# EAGLE design Adafruit_ADS1115_16Bit_I2C_ADC (EAGLE 9.6.2)
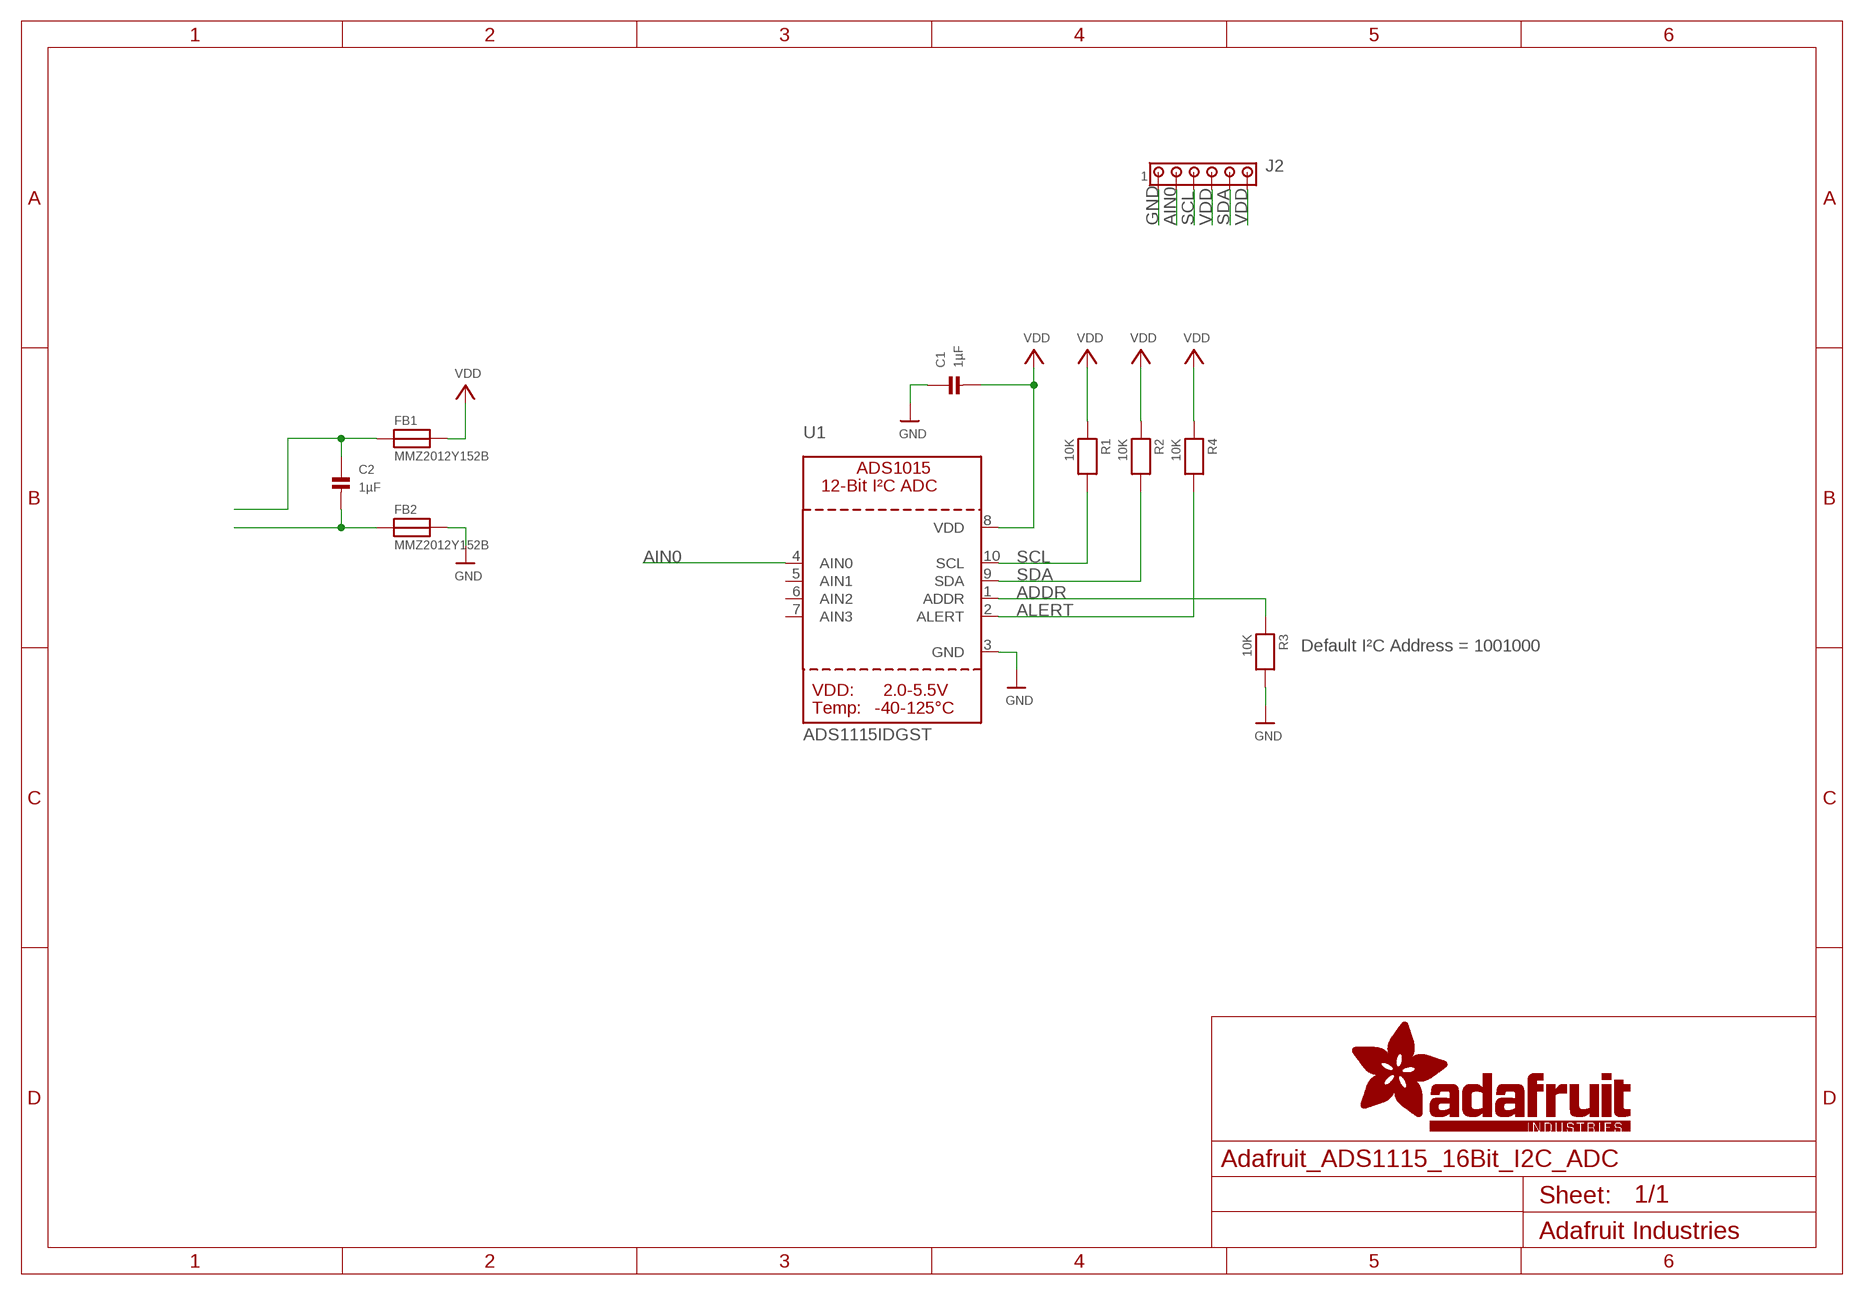
[diagram p0: schematic, sheet 1]

## Parts
C1  1µF  CAP_CERAMIC0805  [0805]
C2  1µF  CAP_CERAMIC0805  [0805]
FB1  MMZ2012Y152B  FERRITE0805  [0805]
FB2  MMZ2012Y152B  FERRITE0805  [0805]
J2  MTA06-156  [1X6MTA]
R1  10K  RESISTOR0805  [0805]
R2  10K  RESISTOR0805  [0805]
R3  10K  RESISTOR0805  [0805]
R4  10K  RESISTOR0805  [0805]
U1  ADS1115IDGST  ADC_ADS1015  [MSOP10]

## Nets
ADDR: R3.1 U1.1(ADDR)
AIN0: J2.2 U1.4(AIN0)
ALERT: R4.2 U1.2(ALERT)
GND: C1.1 FB2.2 J2.1 R3.2 U1.3(GND)
N$1: C2.1 FB1.1
N$2: C2.2 FB2.1
SCL: J2.3 R1.2 U1.10(SCL)
SDA: J2.5 R2.2 U1.9(SDA)
VDD: C1.2 FB1.2 J2.4 J2.6 R1.1 R2.1 R4.1 U1.8(VDD)
Unconnected: U1.5(AIN1) U1.6(AIN2) U1.7(AIN3)

## Notes on the sheet
- Default I²C Address = 1001000

## Library data of the parts
C1 C2 = microbuilder:CAP_CERAMIC: Ceramic Capacitors 0402 - 0402 Surface Mount Capacitors 16pF 50V 5% [Digikey: 445-4899-2-ND] 18pF 50V 5% [Digikey: 490-1281-2-ND] 22pF 50V 5% [Digikey: 490-1283-2-ND] 68pF 50V 5% [Digikey: 490-1289-2-ND] 0.1uF 10V 10% [Digikey: 490-1318-2-ND] 1.0uF 6.3V 10% [Digikey: 490-1320-2-ND] 0603 - 0603 Surface Mount Capacitors 16 pF 50V 5% [Digikey: 445-5051-2-ND] 22 pF 50V [Digikey: PCC220ACVTR-ND] 33 pF 50V 5% [Digikey: 490-1415-1-ND] 56pF 50V 5% [Digikey: 490-1421-1-ND] 220pF 50V 5% [Digikey: 445-1285-1-ND] 680 pF 50V 2200 pF 50V 5% C0G [Digikey: 445-1297-1-ND] 5600 pF 100V 5% X7R [Digikey: 478-3711-1-ND] 0.1 µF 25V 10% [Digikey: PCC2277TR-ND] 0.22 µF 16V 10% X7R [Digikey: 445-1318-1-ND] 1.0 µF 25V 10% [Digikey: 445-5146-2-ND] 0603 - RF Specific 3pF 250V +/-0.1pF RF [Digikey: 712-1347-1-ND] 18 pF 250V 5% [Digikey: 478-3505-1-ND or 712-1322-1-ND] 56 pF 250V 5% C0G RF [Digikey: 490-4867-1-ND] 68 pF 250V RF [Digikey: 490-4868-1-ND] 0805 - 0805 Surface Mount Capacitors 220 pF 250V 2% RF Ceramic Capacitor [Digikey: 712-1398-1-ND] 1000 pF 50V 2% NP0 Ceramic Capacitor [Digikey: 478-3760-1-ND] 0.1 µF 25V 10% Ceramic Capacitor [Digikey: PCC1828TR-ND] 1.0 µF 16V 10% Ceramic Capacitor[Digikey: 490-1691-2-ND] 10.0 µF 10V 10% Ceramic Capacitor[Digikey: 709-1228-1-ND] 10.0 uF 16V 10% Ceramic Capacitor [Digikey: 478-5165-2-ND] 47 uF 6.3V 20% Ceramic Capacitor [Digikey: 587-1779-1-ND or 399-5506-1-ND] 1206 - 1206 Surface Mount Capacitors 47uF 10V 20% Ceramic Capacitor [Digikey: 490-5528-1-ND or 399-5508-1-ND or 445-6010-1-ND] 100uF 6.3V -20%, +80% Y5V Ceramic Capacitor (Digikey: 490-4512-1-ND, Mouser: 81-GRM31CF50J107ZE1L)
FB1 FB2 = microbuilder:FERRITE: Ferrite Bead 0603 MMZ1608B121C - 120 Ohm, 600mA Ferrite Chip - Digikey: 445-2164-1-ND BK1608HW121-T - 120 Ohm, 600mA Ferrite Chip - Digikey: 587-1876-2-ND 0805 HZ0805B272R-10 - 2.7K Ohm @ 100MHz, 200mA 0.8 Ohm DC Resistance - Digikey: 240-2504-1-ND (see also Murata BLM21BD272SN1L)
J2 = con-amp:MTA06-156: AMP connector
R1-R4 = microbuilder:RESISTOR: Resistors 0402 - 0402 Surface Mount Package 22 Ohm 1% 1/16W [Digikey: 311-22.0LRTR-ND] 33 Ohm 5% 1/16W 1.0K 5% 1/16W 1.5K 5% 1/16W 2.0K 1% 1/16W 10.0K 1% 1/16W [Digikey: 311-10.0KLRTR-ND] 10.0K 5% 1/16W [Digikey: RMCF0402JT10K0TR-ND] 12.1K 1% 1/16W [Digikey: 311-22.0LRTR-ND] 100.0K 5% 1/16W 0603 - 0603 Surface Mount Package 0 Ohm 1/10 Watt 1% Resistor 15 Ohm 1/10 Watt 1% Resistor 33 Ohm 1/10 Watt 1% Resistor 49.9 Ohm 1/10 Watt 1% Resistor 100 Ohm 1/10 Watt 1% Resistor 150 Ohm 1/10 Watt 1% Resistor 240 Ohm 1/10 Watt 1% Resistor 390 Ohm 1/10 Watt 1% Resistor 560 Ohm 1/10 Watt 1% Resistor 680 Ohm 1/10 Watt 1% Resistor 750 Ohm 1/10 Watt 1% Resistor 1.0K Ohm 1/10 Watt 1% Resistor 1.5K Ohm 1/10 Watt 1% Resistor 2.0K Ohm 1/10 Watt 1% Resistor 2.2K Ohm 1/10 Watt 1% Resistor 3.3K Ohm 1/10 Watt 1% Resistor 4.7K Ohm 1/10 Watt 1% Resistor 10.0K Ohm 1/10 Watt 1% Resistor 12.0K Ohm 1/10 Watt 1% Resistor 12.1K Ohm 1/10 Watt 1% Resistor 20.0K Ohm 1/10 Watt 1% Resistor 33.0K Ohm 1/10 Watt 1% Resistor 100.0K Ohm 1/10 Watt 1% Resistor 0805 - 0805 Surface Mount Package 0 Ohm 1/8 Watt 1% Resistor 33 Ohm 1/8 Watt 1% Resistor 100 Ohm 1/8 Watt 1% Resistor 150 Ohm 1/8 Watt 1% Resistor 200 Ohm 1/8 Watt 1% Resistor 240 Ohm 1/8 Watt 1% Resistor 330 Ohm 1/8 Watt 1% Resistor 390 Ohm 1/8 Watt 1% Resistor 470 Ohm 1/8 Watt 1% Resistor 1.0K Ohm 1/8 Watt 1% Resistor 1.5K Ohm 1/8 Watt 1% Resistor 2.0K Ohm 1/8 Watt 1% Resistor 4.7K Ohm 1/8 Watt 1% Resistor 5.1K Ohm 1/8 Watt 1% Resistor 5.6K Ohm 1/8 Watt 1% Resistor 10.0K Ohm 1/8 Watt 1% Resistor 22.0K Ohm 1/8 Watt 1% Resistor 33.0K Ohm 1/8 Watt 1% Resistor 100K Ohm 1/8 Watt 1% Resistor 1206 - 1206 Surface Mount Package 2012 - 2010 Surface Mount Package 0.11 Ohm 1/2 Watt 1% Resistor - Digikey: RHM.11UCT-ND
U1 = microbuilder:ADC_ADS1015: ADS1015 - 12-bit 4-Channel I2C ADC with Internal PGA VDD: 2.0-5.5V Sampling Rate: 3.3ksps Gain Settings: 2/3, 1, 2, 4, 8, 16 I2C Address: ADDR low = 1001000x, ADDR high = 1001001x Internal Comparator The ADS1015 includes an internal comparator that can be set to output a high-level on ALERT when the conversion results exceeeds a pre-defined upper level, and will deassert itself when the level falls below a pre-defined lower threshold level. It can also be set to windowed mode where the ALERT pin will be asserted if the data exceeds the upper threshold or falls below the lower threshold.

## Board
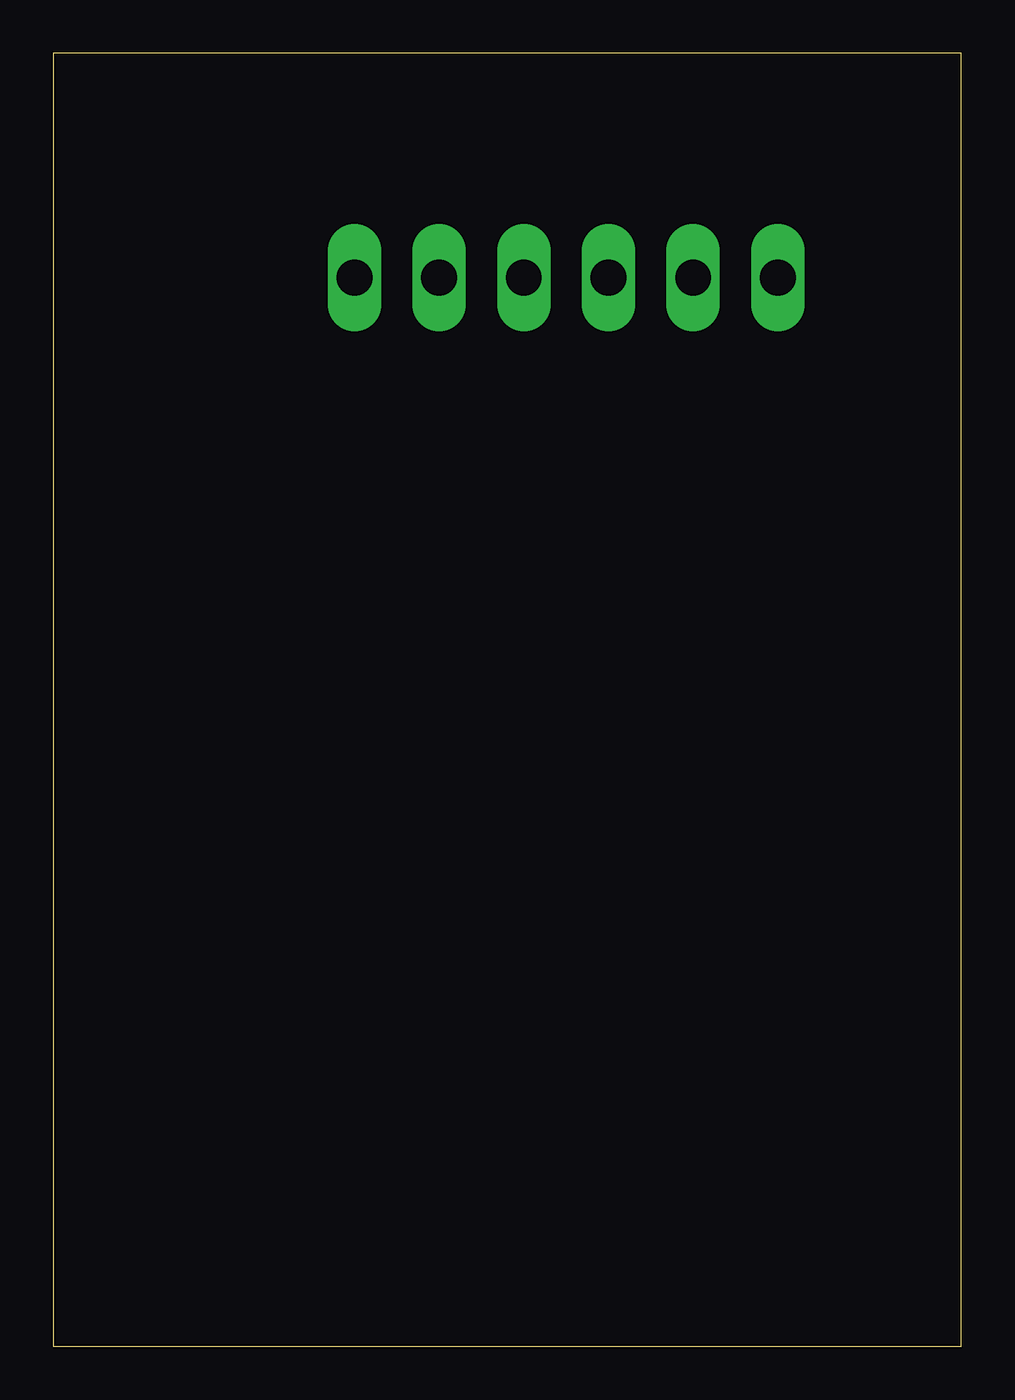
[diagram p1: board, top side]
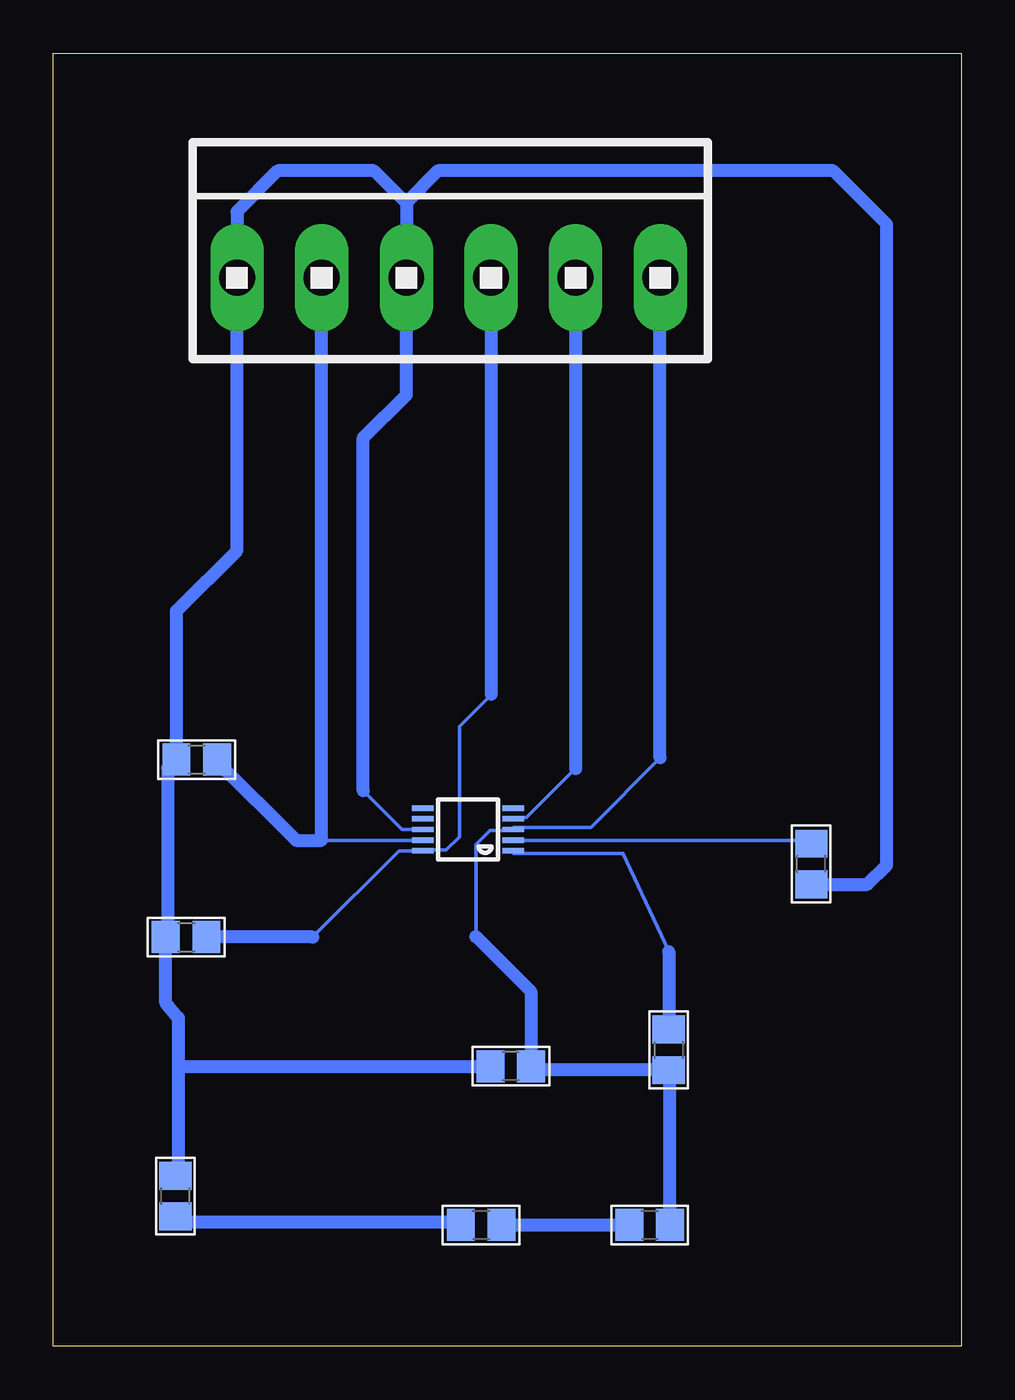
[diagram p2: board, bottom side, seen from below]

Size 42.5 x 60.5 mm. Coordinates in mm from the lower left corner, seen from the top.
Outline: 0,0 42.5,0 42.5,60.5 0,60.5 0,0
Copper layers (1*16): Top 0.035mm / dielectric 1.5mm / Bottom 0.035mm
Design rules "default": minimum track width 6mil, minimum drill 0.35mm, track to track 6mil, track to pad 6mil, pad to pad 6mil, via to via 6mil, smd to smd 6mil, copper to edge 40mil, drill to drill 6mil, minimum pad ring 10mil, minimum via ring 8mil, stop-mask expansion 4mil, vias tented up to drill 0mil, thermal gap 10mil

### Footprints (pad centres in the part's own frame; a part is rotated, then mirrored left to right if it is on the bottom)
0805 = smd 1.3 x 1.5: 1 -0.95,0; 2 0.95,0
1X6MTA = drill 1.676 long: 1 9.906,0; 2 5.944,0; 3 1.981,0; 4 -1.981,0; 5 -5.944,0; 6 -9.906,0
MSOP10 = smd 0.25 x 1: 1 -1,-2.113; 2 -0.5,-2.113; 3 0,-2.113; 4 0.5,-2.113; 5 1,-2.113; 6 1,2.113; 7 0.5,2.113; 8 0,2.113; 9 -0.5,2.113; 10 -1,2.113

### Placement (x,y rotation side)
C1  21.09,13.1 180 bottom
C2  22.48,5.67 0 bottom
FB1  36.79,7.02 90 bottom
FB2  14.59,5.67 0 bottom
J2  24,50 0 bottom
R1  36.29,19.14 0 bottom
R2  35.79,27.45 0 bottom
R3  13.7,13.87 270 bottom
R4  7.03,22.56 90 bottom
U1  23.09,24.18 90 bottom

### Tracks (layer width: path | path; a pad name or v marks a point on that pad's centre or on a via)
ADDR
  Bottom 0.152: U1.1 20.96,23.06 15.85,23.06 13.7,18.46
  Bottom 0.61: 13.7,18.46 R3.1
AIN0
  Bottom 0.152: 18.06,27.02 20.35,24.74 20.96,24.74 U1.4 | 18.06,49.89 J2.2
  Bottom 0.61: 18.06,49.89 18.06,27.02
ALERT
  Bottom 0.152: U1.2 20.96,23.67 7.24,23.67 7.09,23.52 R4.2
GND
  Bottom 0.152: 22.72,19.17 22.72,23.48 22.07,24.13 21.11,24.13 U1.3 20.96,24.28 17.35,24.28 14.1,27.53 | 13.65,5.81 FB2.2 | 13.75,12.95 R3.2 13.64,12.86 | 14.1,49.89 J2.1 | 20.15,13.1 20.15,12.95 C1.1 20.15,13.1
  Bottom 0.61: 22.72,19.17 20.15,16.6 20.15,13.1 | 20.15,12.95 13.75,12.95 | 14.1,27.53 14.1,49.89 | FB2.2 13.64,12.86
N$1
  Bottom 0.152: 36.5,5.81 36.65,5.96 FB1.1 | 23.45,5.81 C2.1
  Bottom 0.61: 36.5,5.81 23.45,5.81
N$2
  Bottom 0.152: 21.47,5.66 C2.2 | 15.63,5.66 FB2.1
  Bottom 0.61: 15.63,5.66 21.47,5.66
SCL
  Bottom 0.152: R1.2 35.26,19.06 | 30.36,19.14 26.32,23.18 U1.10 25.07,23.22 24.11,23.22 23.5,23.83 23.5,29 22,30.5 | 22,49.98 J2.3
  Bottom 0.61: 30.36,19.14 R1.2 | 22,30.5 22,49.98
SDA
  Bottom 0.152: 29.95,23.67 25.22,23.67 U1.9 | 34.83,27.35 R2.2 | 29.95,49.89 J2.5
  Bottom 0.61: 34.83,27.35 31.15,23.67 29.95,23.67 29.95,49.89
VDD
  Bottom 0.152: 33.76,50.04 J2.6 33.91,49.89 | 36.65,8.09 FB1.2 | R2.1 37.15,27.04 | 37.15,19.19 R1.1 | 21.98,13.1 C1.2 | U1.8 26.18,24.18 28,26 | J2.4 25.98,53.48
  Bottom 0.61: 36.65,13.1 36.65,15.36 37.24,16.05 R1.1 | 36.65,13.1 36.65,8.09 | 37.15,27.04 37.15,19.19 | 36.65,13.1 C1.2 | R2.1 36.74,34.41 33.91,37.24 33.91,49.89 33.91,53.09 32,55 27.5,55 25.98,53.48 | 28,26 28,42.5 25.98,44.52 J2.4 25.98,53.52 24.5,55 6,55 3.5,52.5 3.5,22.5 4.39,21.61 R4.1